# EAGLE schematic DM04mux (EAGLE 6.6.0)

## Sheet 1 of 3
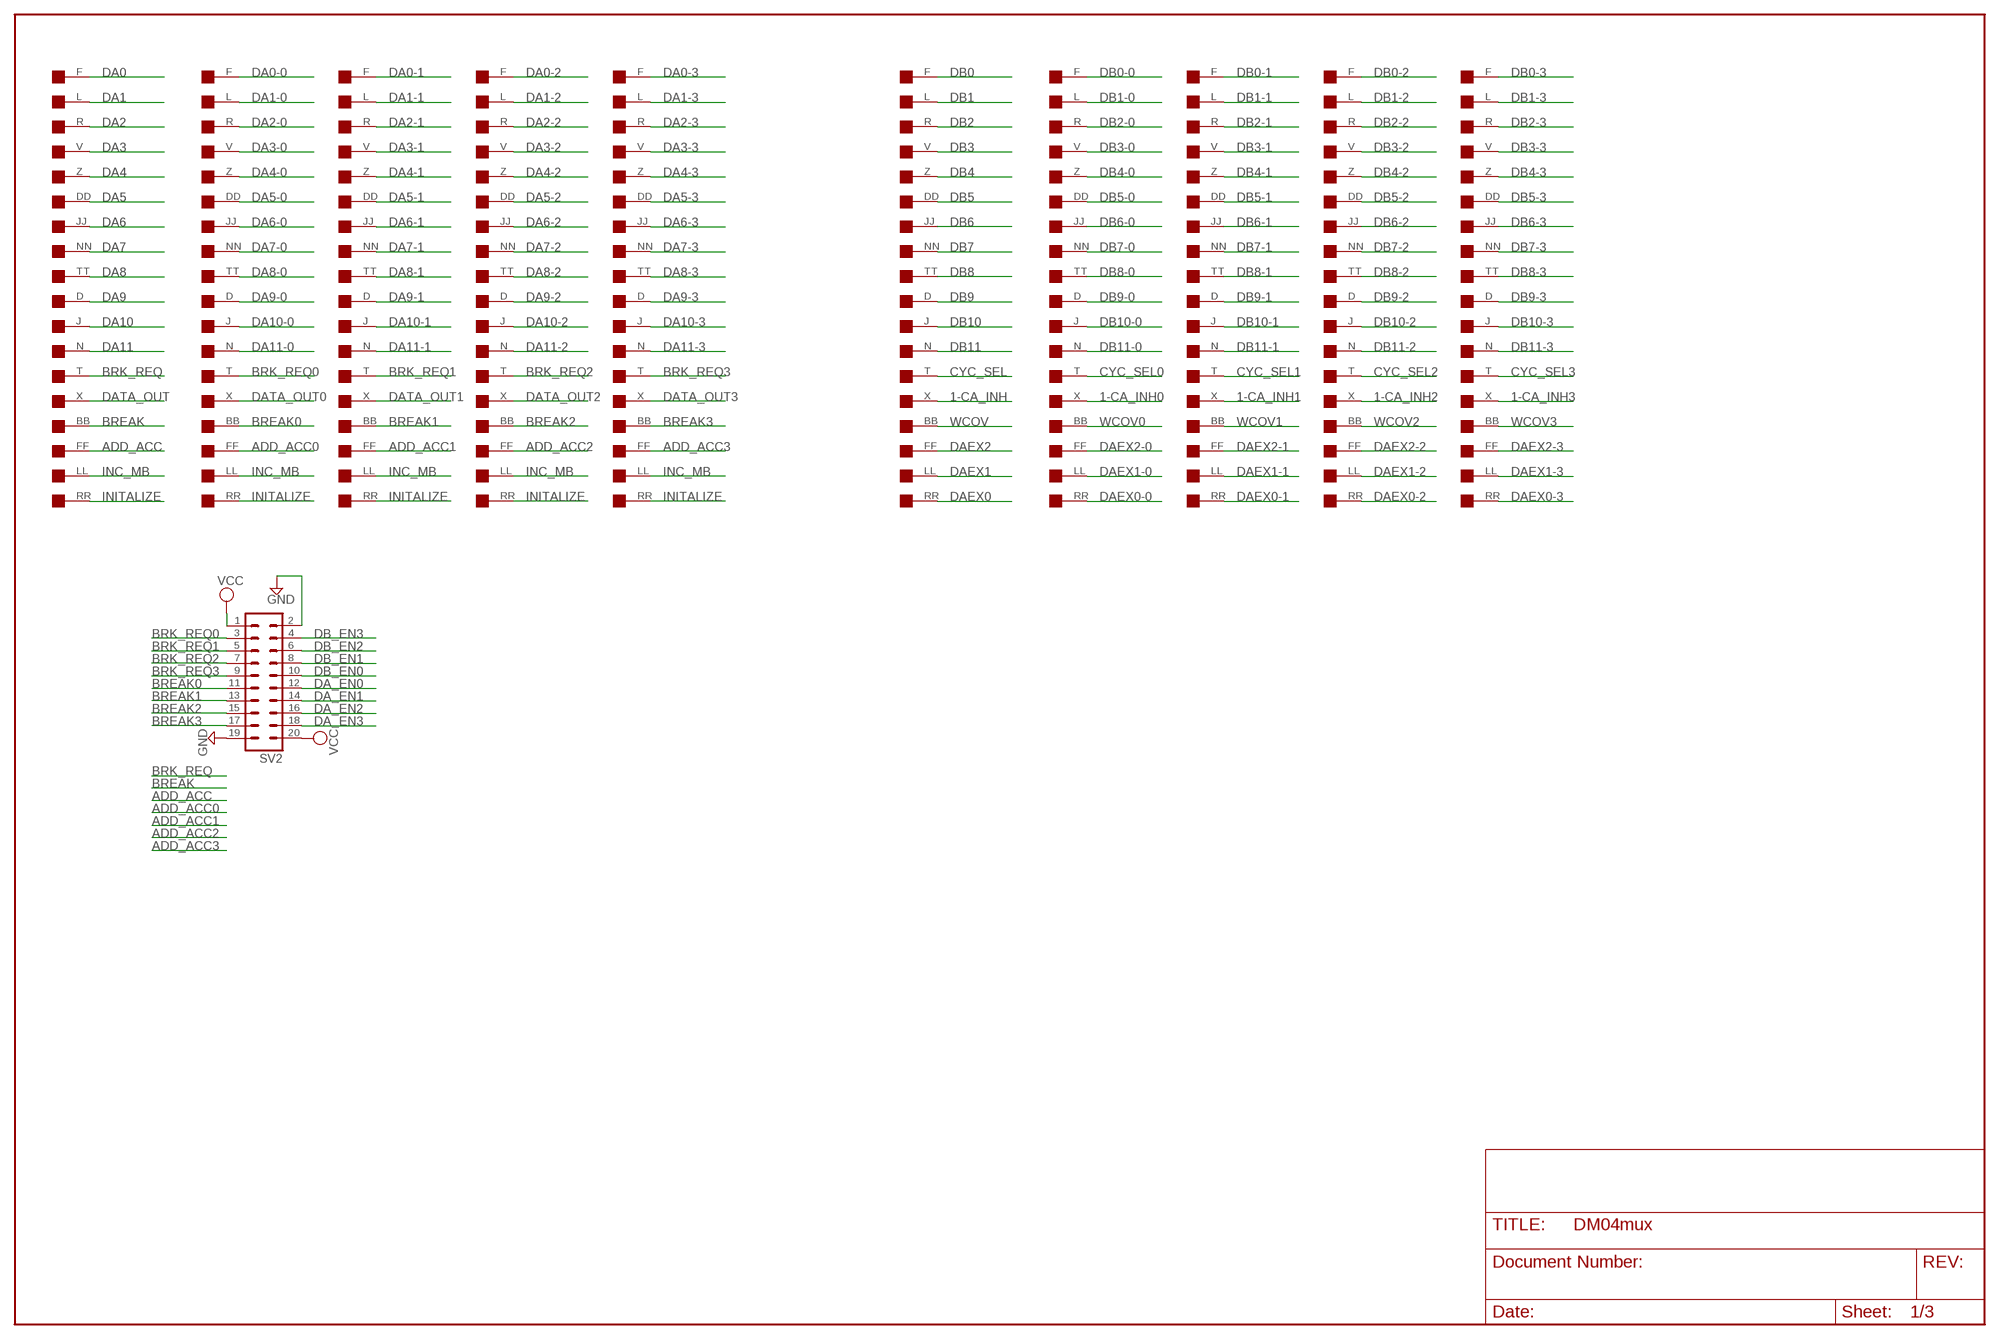
[diagram p0: schematic, sheet 1]

### Parts
SV2  MA10-2  [MA10-2]
U$1  BC08J  [DEC40PINV]
U$2  BC08J  [DEC40PINV]
U$3  BC08J  [DEC40PINV]
U$4  BC08J  [DEC40PINV]
U$5  BC08J  [DEC40PINV]
U$6  BC08J  [DEC40PINV]
U$7  BC08J  [DEC40PINV]
U$8  BC08J  [DEC40PINV]
U$9  BC08J  [DEC40PINV]
U$10  BC08J  [DEC40PINV]

### Nets
1-CA_INH: U$6.X ; also sheet 3
1-CA_INH0: U$7.X ; also sheet 3
1-CA_INH1: U$8.X ; also sheet 3
1-CA_INH2: U$9.X ; also sheet 3
1-CA_INH3: U$10.X ; also sheet 3
ADD_ACC: U$1.FF
ADD_ACC0: U$2.FF
ADD_ACC1: U$3.FF
ADD_ACC2: U$4.FF
ADD_ACC3: U$5.FF
BREAK: U$1.BB
BREAK0: SV2.11 U$2.BB
BREAK1: SV2.13 U$3.BB
BREAK2: SV2.15 U$4.BB
BREAK3: SV2.17 U$5.BB
BRK_REQ: U$1.T
BRK_REQ0: SV2.3 U$2.T
BRK_REQ1: SV2.5 U$3.T
BRK_REQ2: SV2.7 U$4.T
BRK_REQ3: SV2.9 U$5.T
CYC_SEL: U$6.T ; also sheet 2
CYC_SEL0: U$7.T ; also sheet 2
CYC_SEL1: U$8.T ; also sheet 2
CYC_SEL2: U$9.T ; also sheet 2
CYC_SEL3: U$10.T ; also sheet 2
DA0: U$1.F ; also sheet 2
DA0-0: U$2.F ; also sheet 2
DA0-1: U$3.F ; also sheet 2
DA0-2: U$4.F ; also sheet 2
DA0-3: U$5.F ; also sheet 2
DA1: U$1.L ; also sheet 2
DA1-0: U$2.L ; also sheet 2
DA1-1: U$3.L ; also sheet 2
DA1-2: U$4.L ; also sheet 2
DA1-3: U$5.L ; also sheet 2
DA2: U$1.R ; also sheet 2
DA2-0: U$2.R ; also sheet 2
DA2-1: U$3.R ; also sheet 2
DA2-2: U$4.R ; also sheet 2
DA2-3: U$5.R ; also sheet 2
DA3: U$1.V ; also sheet 2
DA3-0: U$2.V ; also sheet 2
DA3-1: U$3.V ; also sheet 2
DA3-2: U$4.V ; also sheet 2
DA3-3: U$5.V ; also sheet 2
DA4: U$1.Z ; also sheet 2
DA4-0: U$2.Z ; also sheet 2
DA4-1: U$3.Z ; also sheet 2
DA4-2: U$4.Z ; also sheet 2
DA4-3: U$5.Z ; also sheet 2
DA5: U$1.DD ; also sheet 2
DA5-0: U$2.DD ; also sheet 2
DA5-1: U$3.DD ; also sheet 2
DA5-2: U$4.DD ; also sheet 2
DA5-3: U$5.DD ; also sheet 2
DA6: U$1.JJ ; also sheet 2
DA6-0: U$2.JJ ; also sheet 2
DA6-1: U$3.JJ ; also sheet 2
DA6-2: U$4.JJ ; also sheet 2
DA6-3: U$5.JJ ; also sheet 2
DA7: U$1.NN ; also sheet 2
DA7-0: U$2.NN ; also sheet 2
DA7-1: U$3.NN ; also sheet 2
DA7-2: U$4.NN ; also sheet 2
DA7-3: U$5.NN ; also sheet 2
DA8: U$1.TT ; also sheet 2
DA8-0: U$2.TT ; also sheet 2
DA8-1: U$3.TT ; also sheet 2
DA8-2: U$4.TT ; also sheet 2
DA8-3: U$5.TT ; also sheet 2
DA9: U$1.D ; also sheet 2
DA9-0: U$2.D ; also sheet 2
DA9-1: U$3.D ; also sheet 2
DA9-2: U$4.D ; also sheet 2
DA9-3: U$5.D ; also sheet 2
DA10: U$1.J ; also sheet 2
DA10-0: U$2.J ; also sheet 2
DA10-1: U$3.J ; also sheet 2
DA10-2: U$4.J ; also sheet 2
DA10-3: U$5.J ; also sheet 2
DA11: U$1.N ; also sheet 2
DA11-0: U$2.N ; also sheet 2
DA11-1: U$3.N ; also sheet 2
DA11-2: U$4.N ; also sheet 2
DA11-3: U$5.N ; also sheet 2
DA_EN0: SV2.12 ; also sheet 2
DA_EN1: SV2.14 ; also sheet 2
DA_EN2: SV2.16 ; also sheet 2
DA_EN3: SV2.18 ; also sheet 2
DAEX0: U$6.RR ; also sheet 2
DAEX0-0: U$7.RR ; also sheet 2
DAEX0-1: U$8.RR ; also sheet 2
DAEX0-2: U$9.RR ; also sheet 2
DAEX0-3: U$10.RR ; also sheet 2
DAEX1: U$6.LL ; also sheet 2
DAEX1-0: U$7.LL ; also sheet 2
DAEX1-1: U$8.LL ; also sheet 2
DAEX1-2: U$9.LL ; also sheet 2
DAEX1-3: U$10.LL ; also sheet 2
DAEX2: U$6.FF ; also sheet 2
DAEX2-0: U$7.FF ; also sheet 2
DAEX2-1: U$8.FF ; also sheet 2
DAEX2-2: U$9.FF ; also sheet 2
DAEX2-3: U$10.FF ; also sheet 2
DATA_OUT: U$1.X ; also sheet 3
DATA_OUT0: U$2.X ; also sheet 3
DATA_OUT1: U$3.X ; also sheet 3
DATA_OUT2: U$4.X ; also sheet 3
DATA_OUT3: U$5.X ; also sheet 3
DB0: U$6.F ; also sheet 3
DB0-0: U$7.F ; also sheet 3
DB0-1: U$8.F ; also sheet 3
DB0-2: U$9.F ; also sheet 3
DB0-3: U$10.F ; also sheet 3
DB1: U$6.L ; also sheet 3
DB1-0: U$7.L ; also sheet 3
DB1-1: U$8.L ; also sheet 3
DB1-2: U$9.L ; also sheet 3
DB1-3: U$10.L ; also sheet 3
DB2: U$6.R ; also sheet 3
DB2-0: U$7.R ; also sheet 3
DB2-1: U$8.R ; also sheet 3
DB2-2: U$9.R ; also sheet 3
DB2-3: U$10.R ; also sheet 3
DB3: U$6.V ; also sheet 3
DB3-0: U$7.V ; also sheet 3
DB3-1: U$8.V ; also sheet 3
DB3-2: U$9.V ; also sheet 3
DB3-3: U$10.V ; also sheet 3
DB4: U$6.Z ; also sheet 3
DB4-0: U$7.Z ; also sheet 3
DB4-1: U$8.Z ; also sheet 3
DB4-2: U$9.Z ; also sheet 3
DB4-3: U$10.Z ; also sheet 3
DB5: U$6.DD ; also sheet 3
DB5-0: U$7.DD ; also sheet 3
DB5-1: U$8.DD ; also sheet 3
DB5-2: U$9.DD ; also sheet 3
DB5-3: U$10.DD ; also sheet 3
DB6: U$6.JJ ; also sheet 3
DB6-0: U$7.JJ ; also sheet 3
DB6-1: U$8.JJ ; also sheet 3
DB6-2: U$9.JJ ; also sheet 3
DB6-3: U$10.JJ ; also sheet 3
DB7: U$6.NN ; also sheet 3
DB7-0: U$7.NN ; also sheet 3
DB7-1: U$8.NN ; also sheet 3
DB7-2: U$9.NN ; also sheet 3
DB7-3: U$10.NN ; also sheet 3
DB8: U$6.TT ; also sheet 3
DB8-0: U$7.TT ; also sheet 3
DB8-1: U$8.TT ; also sheet 3
DB8-2: U$9.TT ; also sheet 3
DB8-3: U$10.TT ; also sheet 3
DB9: U$6.D ; also sheet 3
DB9-0: U$7.D ; also sheet 3
DB9-1: U$8.D ; also sheet 3
DB9-2: U$9.D ; also sheet 3
DB9-3: U$10.D ; also sheet 3
DB10: U$6.J ; also sheet 3
DB10-0: U$7.J ; also sheet 3
DB10-1: U$8.J ; also sheet 3
DB10-2: U$9.J ; also sheet 3
DB10-3: U$10.J ; also sheet 3
DB11: U$6.N ; also sheet 3
DB11-0: U$7.N ; also sheet 3
DB11-1: U$8.N ; also sheet 3
DB11-2: U$9.N ; also sheet 3
DB11-3: U$10.N ; also sheet 3
DB_EN0: SV2.10 ; also sheet 3
DB_EN1: SV2.8 ; also sheet 3
DB_EN2: SV2.6 ; also sheet 3
DB_EN3: SV2.4 ; also sheet 3
GND: SV2.2 SV2.19 ; also sheet 3
INC_MB: U$1.LL U$2.LL U$3.LL U$4.LL U$5.LL
INITALIZE: U$1.RR U$2.RR U$3.RR U$4.RR U$5.RR
VCC: SV2.1 SV2.20 ; also sheet 2,3
WCOV: U$6.BB
WCOV0: U$7.BB
WCOV1: U$8.BB
WCOV2: U$9.BB
WCOV3: U$10.BB

## Sheet 2 of 3
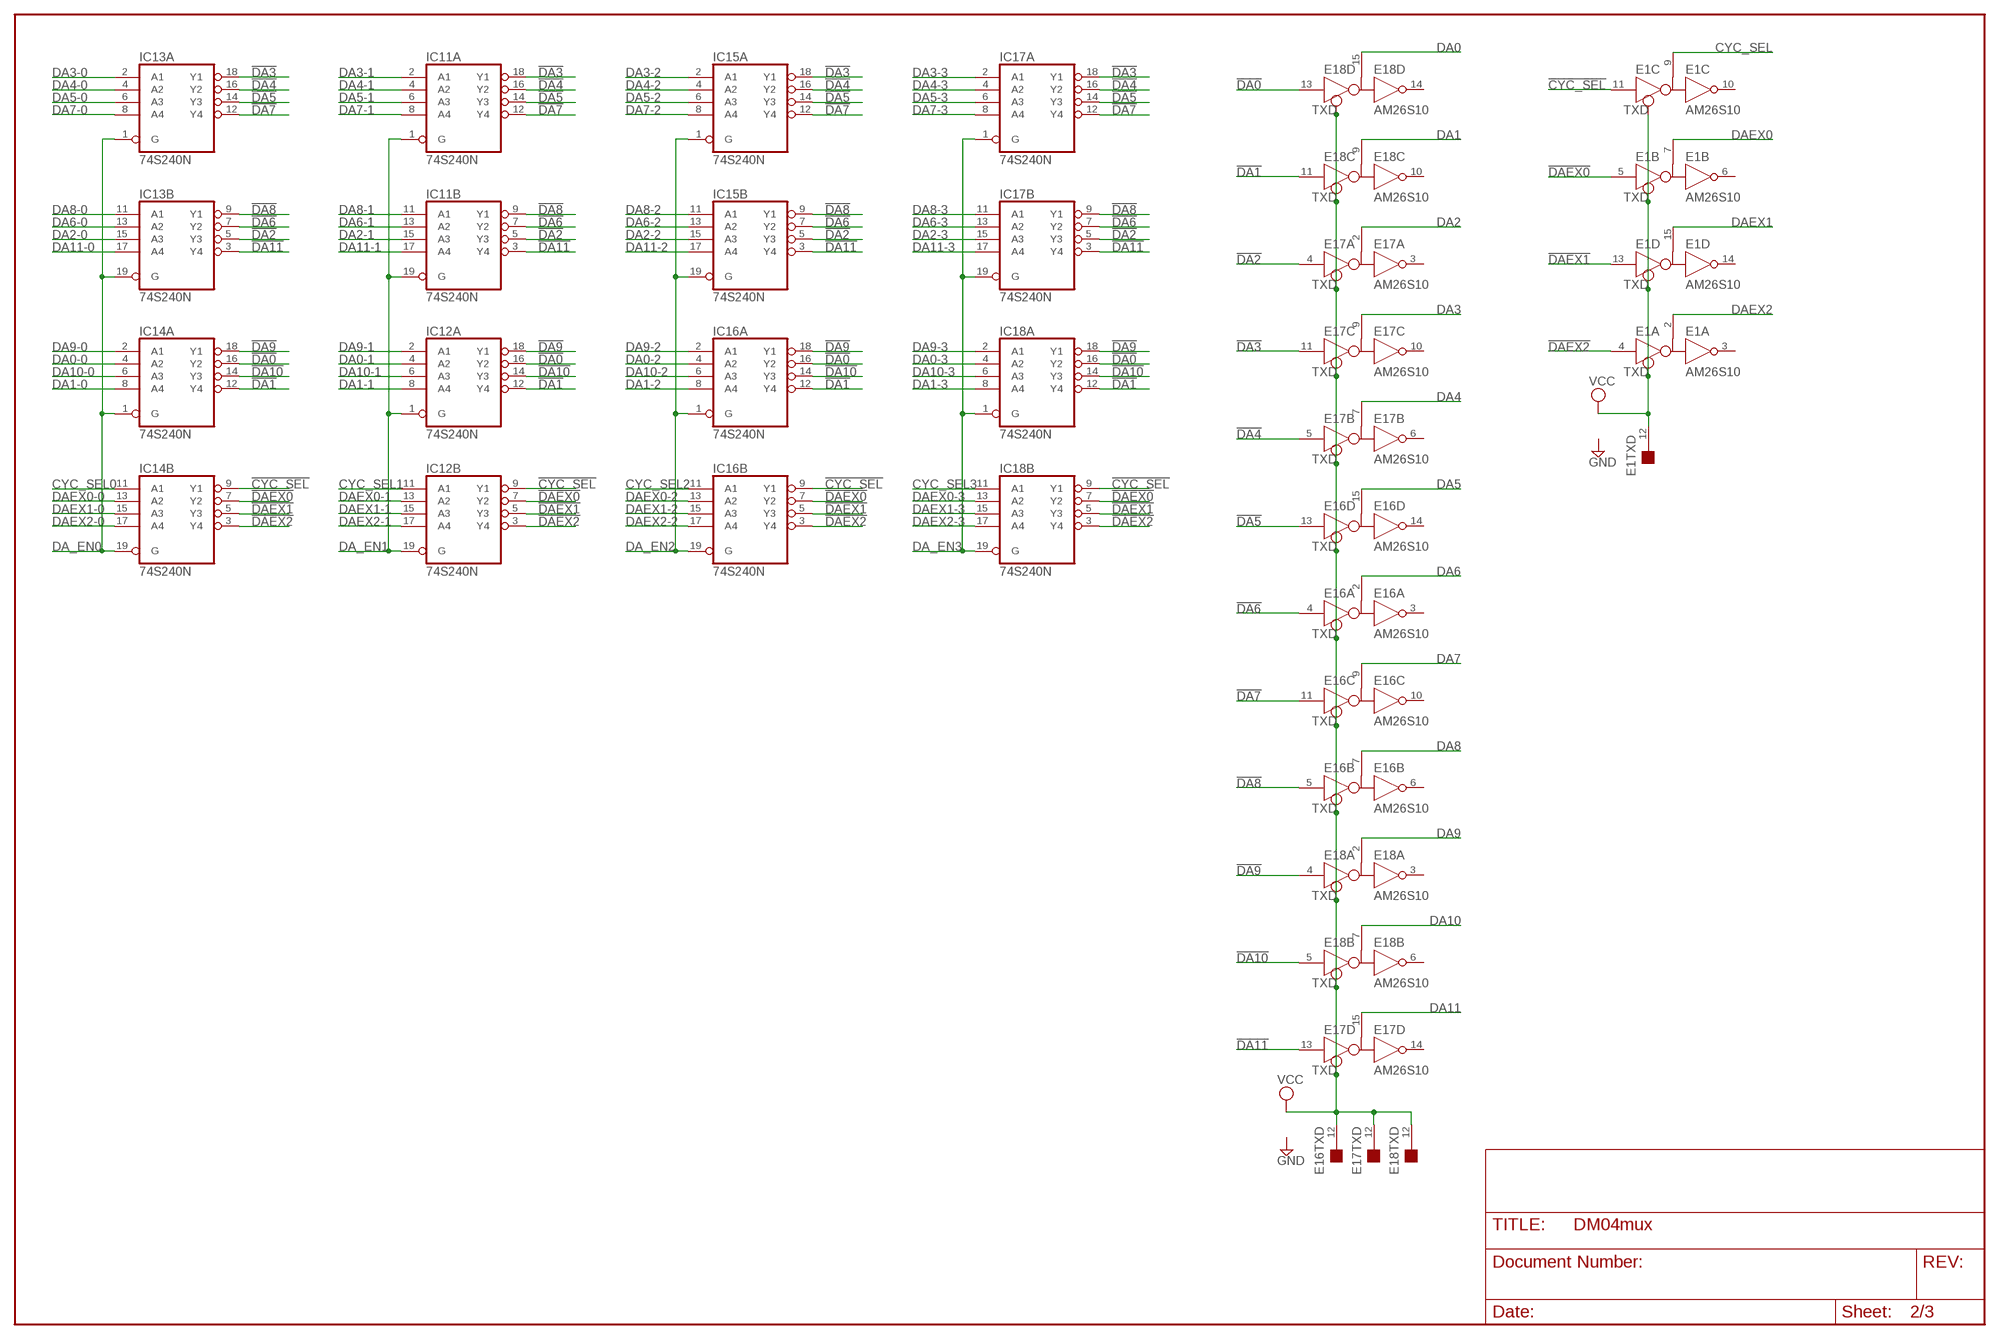
[diagram p1: schematic, sheet 2]

### Parts
E1  AM26S10  [DIL16]
E16  AM26S10  [DIL16]
E17  AM26S10  [DIL16]
E18  AM26S10  [DIL16]
IC11  74S240N  [DIL20]
IC12  74S240N  [DIL20]
IC13  74S240N  [DIL20]
IC14  74S240N  [DIL20]
IC15  74S240N  [DIL20]
IC16  74S240N  [DIL20]
IC17  74S240N  [DIL20]
IC18  74S240N  [DIL20]

### Nets
!CYC_SEL: E1.11(C:D) IC12.9(B:Y1) IC14.9(B:Y1) IC16.9(B:Y1) IC18.9(B:Y1)
!DA0: E18.13(D:D) IC12.16(A:Y2) IC14.16(A:Y2) IC16.16(A:Y2) IC18.16(A:Y2)
!DA1: E18.11(C:D) IC12.12(A:Y4) IC14.12(A:Y4) IC16.12(A:Y4) IC18.12(A:Y4)
!DA2: E17.4(A:D) IC11.5(B:Y3) IC13.5(B:Y3) IC15.5(B:Y3) IC17.5(B:Y3)
!DA3: E17.11(C:D) IC11.18(A:Y1) IC13.18(A:Y1) IC15.18(A:Y1) IC17.18(A:Y1)
!DA4: E17.5(B:D) IC11.16(A:Y2) IC13.16(A:Y2) IC15.16(A:Y2) IC17.16(A:Y2)
!DA5: E16.13(D:D) IC11.14(A:Y3) IC13.14(A:Y3) IC15.14(A:Y3) IC17.14(A:Y3)
!DA6: E16.4(A:D) IC11.7(B:Y2) IC13.7(B:Y2) IC15.7(B:Y2) IC17.7(B:Y2)
!DA7: E16.11(C:D) IC11.12(A:Y4) IC13.12(A:Y4) IC15.12(A:Y4) IC17.12(A:Y4)
!DA8: E16.5(B:D) IC11.9(B:Y1) IC13.9(B:Y1) IC15.9(B:Y1) IC17.9(B:Y1)
!DA9: E18.4(A:D) IC12.18(A:Y1) IC14.18(A:Y1) IC16.18(A:Y1) IC18.18(A:Y1)
!DA10: E18.5(B:D) IC12.14(A:Y3) IC14.14(A:Y3) IC16.14(A:Y3) IC18.14(A:Y3)
!DA11: E17.13(D:D) IC11.3(B:Y4) IC13.3(B:Y4) IC15.3(B:Y4) IC17.3(B:Y4)
!DAEX0: E1.5(B:D) IC12.7(B:Y2) IC14.7(B:Y2) IC16.7(B:Y2) IC18.7(B:Y2)
!DAEX1: E1.13(D:D) IC12.5(B:Y3) IC14.5(B:Y3) IC16.5(B:Y3) IC18.5(B:Y3)
!DAEX2: E1.4(A:D) IC12.3(B:Y4) IC14.3(B:Y4) IC16.3(B:Y4) IC18.3(B:Y4)
CYC_SEL: E1.9(C:B) ; also sheet 1
CYC_SEL0: IC14.11(B:A1) ; also sheet 1
CYC_SEL1: IC12.11(B:A1) ; also sheet 1
CYC_SEL2: IC16.11(B:A1) ; also sheet 1
CYC_SEL3: IC18.11(B:A1) ; also sheet 1
DA0: E18.15(D:B) ; also sheet 1
DA0-0: IC14.4(A:A2) ; also sheet 1
DA0-1: IC12.4(A:A2) ; also sheet 1
DA0-2: IC16.4(A:A2) ; also sheet 1
DA0-3: IC18.4(A:A2) ; also sheet 1
DA1: E18.9(C:B) ; also sheet 1
DA1-0: IC14.8(A:A4) ; also sheet 1
DA1-1: IC12.8(A:A4) ; also sheet 1
DA1-2: IC16.8(A:A4) ; also sheet 1
DA1-3: IC18.8(A:A4) ; also sheet 1
DA2: E17.2(A:B) ; also sheet 1
DA2-0: IC13.15(B:A3) ; also sheet 1
DA2-1: IC11.15(B:A3) ; also sheet 1
DA2-2: IC15.15(B:A3) ; also sheet 1
DA2-3: IC17.15(B:A3) ; also sheet 1
DA3: E17.9(C:B) ; also sheet 1
DA3-0: IC13.2(A:A1) ; also sheet 1
DA3-1: IC11.2(A:A1) ; also sheet 1
DA3-2: IC15.2(A:A1) ; also sheet 1
DA3-3: IC17.2(A:A1) ; also sheet 1
DA4: E17.7(B:B) ; also sheet 1
DA4-0: IC13.4(A:A2) ; also sheet 1
DA4-1: IC11.4(A:A2) ; also sheet 1
DA4-2: IC15.4(A:A2) ; also sheet 1
DA4-3: IC17.4(A:A2) ; also sheet 1
DA5: E16.15(D:B) ; also sheet 1
DA5-0: IC13.6(A:A3) ; also sheet 1
DA5-1: IC11.6(A:A3) ; also sheet 1
DA5-2: IC15.6(A:A3) ; also sheet 1
DA5-3: IC17.6(A:A3) ; also sheet 1
DA6: E16.2(A:B) ; also sheet 1
DA6-0: IC13.13(B:A2) ; also sheet 1
DA6-1: IC11.13(B:A2) ; also sheet 1
DA6-2: IC15.13(B:A2) ; also sheet 1
DA6-3: IC17.13(B:A2) ; also sheet 1
DA7: E16.9(C:B) ; also sheet 1
DA7-0: IC13.8(A:A4) ; also sheet 1
DA7-1: IC11.8(A:A4) ; also sheet 1
DA7-2: IC15.8(A:A4) ; also sheet 1
DA7-3: IC17.8(A:A4) ; also sheet 1
DA8: E16.7(B:B) ; also sheet 1
DA8-0: IC13.11(B:A1) ; also sheet 1
DA8-1: IC11.11(B:A1) ; also sheet 1
DA8-2: IC15.11(B:A1) ; also sheet 1
DA8-3: IC17.11(B:A1) ; also sheet 1
DA9: E18.2(A:B) ; also sheet 1
DA9-0: IC14.2(A:A1) ; also sheet 1
DA9-1: IC12.2(A:A1) ; also sheet 1
DA9-2: IC16.2(A:A1) ; also sheet 1
DA9-3: IC18.2(A:A1) ; also sheet 1
DA10: E18.7(B:B) ; also sheet 1
DA10-0: IC14.6(A:A3) ; also sheet 1
DA10-1: IC12.6(A:A3) ; also sheet 1
DA10-2: IC16.6(A:A3) ; also sheet 1
DA10-3: IC18.6(A:A3) ; also sheet 1
DA11: E17.15(D:B) ; also sheet 1
DA11-0: IC13.17(B:A4) ; also sheet 1
DA11-1: IC11.17(B:A4) ; also sheet 1
DA11-2: IC15.17(B:A4) ; also sheet 1
DA11-3: IC17.17(B:A4) ; also sheet 1
DA_EN0: IC13.1(A:G) IC13.19(B:G) IC14.1(A:G) IC14.19(B:G) ; also sheet 1
DA_EN1: IC11.1(A:G) IC11.19(B:G) IC12.1(A:G) IC12.19(B:G) ; also sheet 1
DA_EN2: IC15.1(A:G) IC15.19(B:G) IC16.1(A:G) IC16.19(B:G) ; also sheet 1
DA_EN3: IC17.1(A:G) IC17.19(B:G) IC18.1(A:G) IC18.19(B:G) ; also sheet 1
DAEX0: E1.7(B:B) ; also sheet 1
DAEX0-0: IC14.13(B:A2) ; also sheet 1
DAEX0-1: IC12.13(B:A2) ; also sheet 1
DAEX0-2: IC16.13(B:A2) ; also sheet 1
DAEX0-3: IC18.13(B:A2) ; also sheet 1
DAEX1: E1.15(D:B) ; also sheet 1
DAEX1-0: IC14.15(B:A3) ; also sheet 1
DAEX1-1: IC12.15(B:A3) ; also sheet 1
DAEX1-2: IC16.15(B:A3) ; also sheet 1
DAEX1-3: IC18.15(B:A3) ; also sheet 1
DAEX2: E1.2(A:B) ; also sheet 1
DAEX2-0: IC14.17(B:A4) ; also sheet 1
DAEX2-1: IC12.17(B:A4) ; also sheet 1
DAEX2-2: IC16.17(B:A4) ; also sheet 1
DAEX2-3: IC18.17(B:A4) ; also sheet 1
VCC: E1.12(TXD:TXD) E16.12(TXD:TXD) E17.12(TXD:TXD) E18.12(TXD:TXD) ; also sheet 1,3
Unconnected: E1.3(A:R) E1.6(B:R) E1.10(C:R) E1.14(D:R) E16.3(A:R) E16.6(B:R) E16.10(C:R) E16.14(D:R) E17.3(A:R) E17.6(B:R) E17.10(C:R) E17.14(D:R) E18.3(A:R) E18.6(B:R) E18.10(C:R) E18.14(D:R)

## Sheet 3 of 3
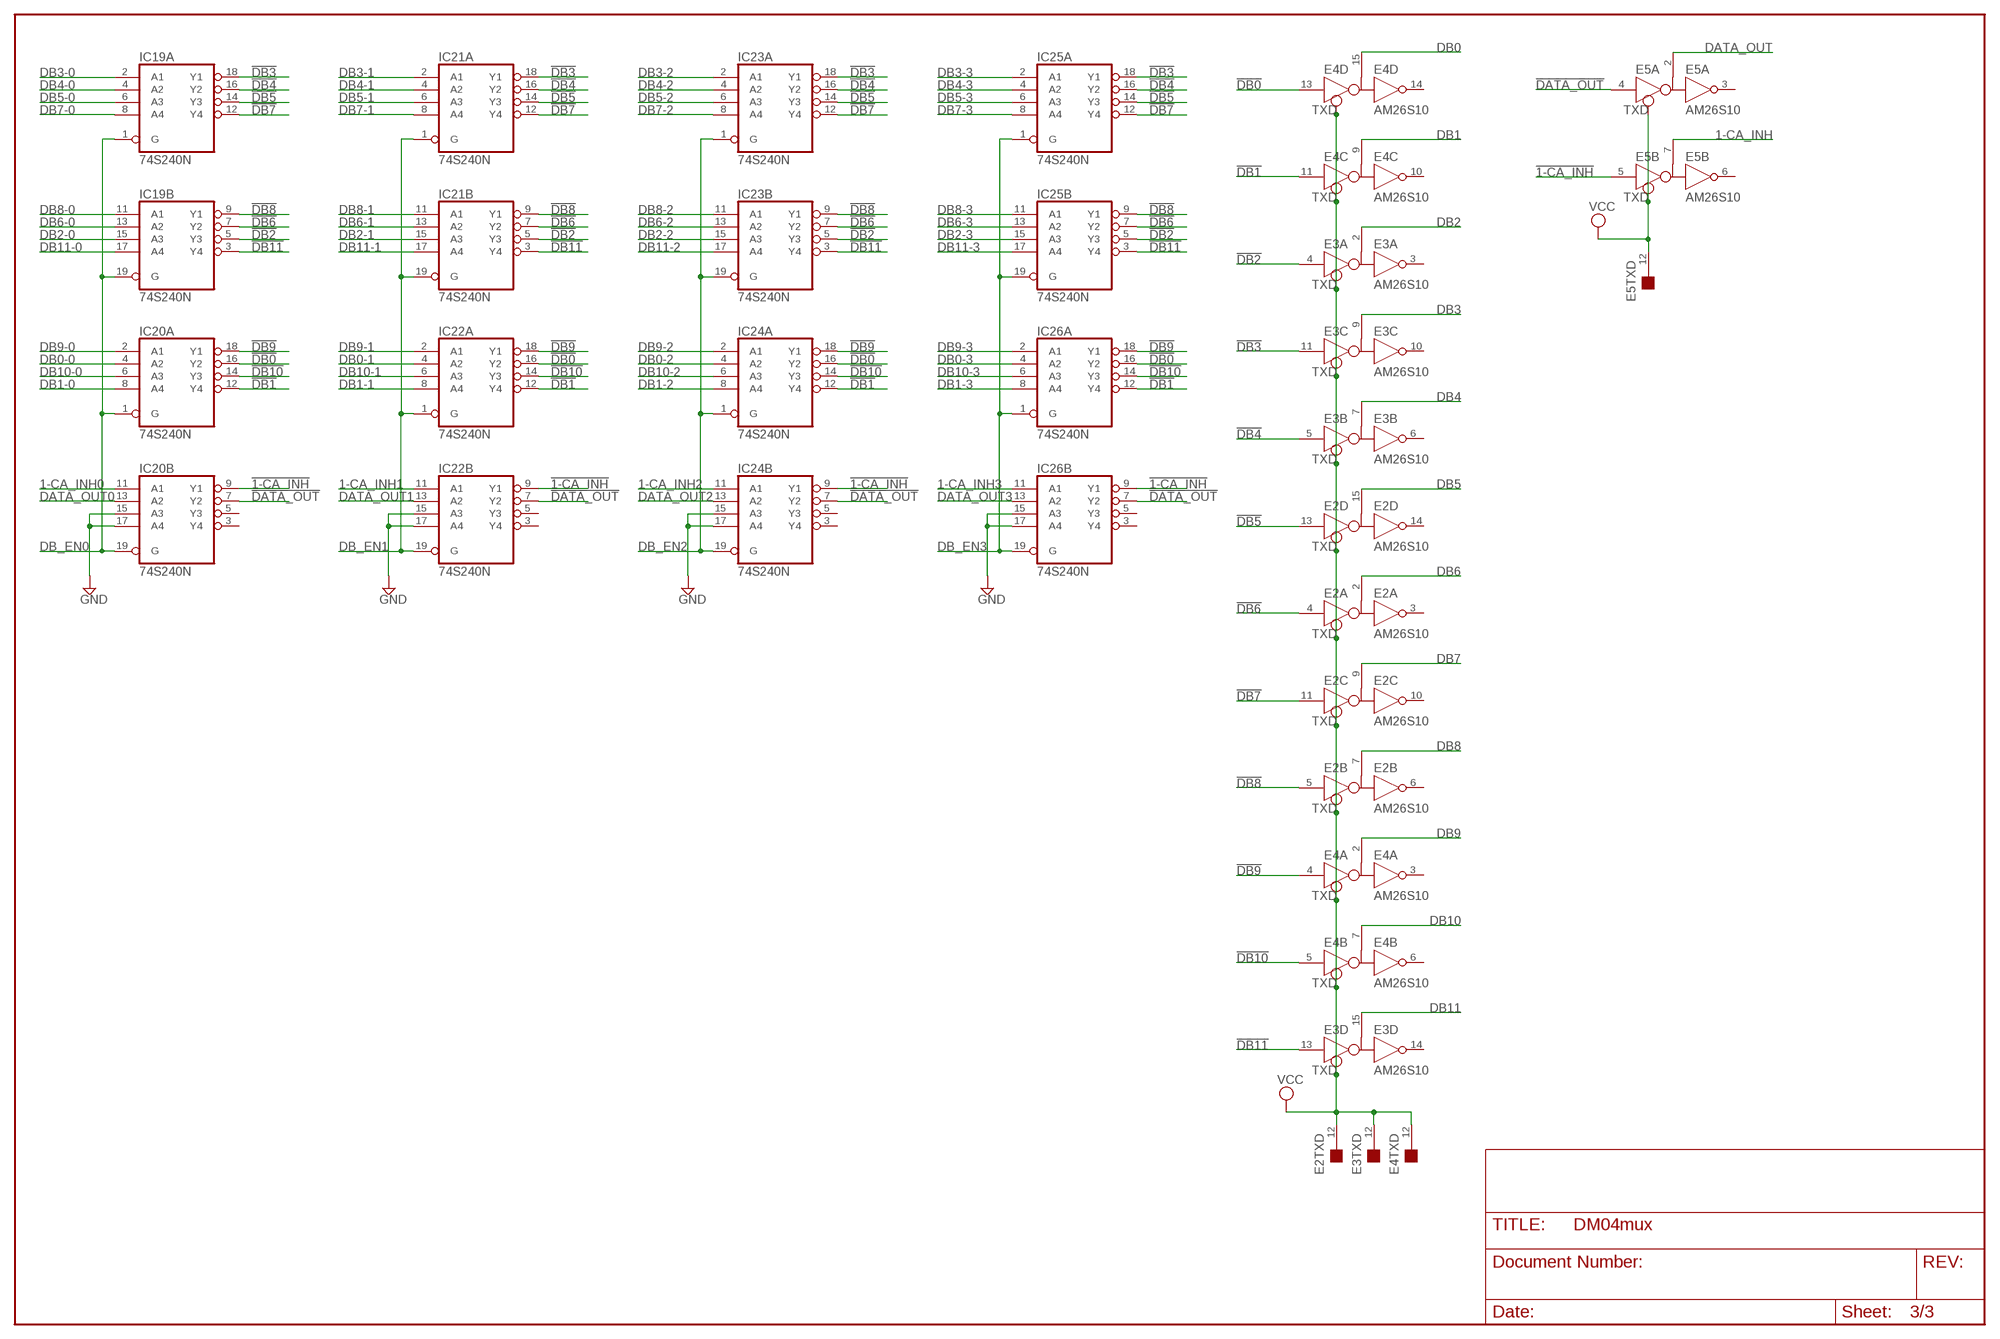
[diagram p2: schematic, sheet 3]

### Parts
E2  AM26S10  [DIL16]
E3  AM26S10  [DIL16]
E4  AM26S10  [DIL16]
E5  AM26S10  [DIL16]
IC19  74S240N  [DIL20]
IC20  74S240N  [DIL20]
IC21  74S240N  [DIL20]
IC22  74S240N  [DIL20]
IC23  74S240N  [DIL20]
IC24  74S240N  [DIL20]
IC25  74S240N  [DIL20]
IC26  74S240N  [DIL20]

### Nets
1-CA_INH: E5.7(B:B) ; also sheet 1
1-CA_INH0: IC20.11(B:A1) ; also sheet 1
1-CA_INH1: IC22.11(B:A1) ; also sheet 1
1-CA_INH2: IC24.11(B:A1) ; also sheet 1
1-CA_INH3: IC26.11(B:A1) ; also sheet 1
!1-CA_INH: E5.5(B:D) IC20.9(B:Y1) IC22.9(B:Y1) IC24.9(B:Y1) IC26.9(B:Y1)
!DATA_OUT: E5.4(A:D) IC20.7(B:Y2) IC22.7(B:Y2) IC24.7(B:Y2) IC26.7(B:Y2)
!DB0: E4.13(D:D) IC20.16(A:Y2) IC22.16(A:Y2) IC24.16(A:Y2) IC26.16(A:Y2)
!DB1: E4.11(C:D) IC20.12(A:Y4) IC22.12(A:Y4) IC24.12(A:Y4) IC26.12(A:Y4)
!DB2: E3.4(A:D) IC19.5(B:Y3) IC21.5(B:Y3) IC23.5(B:Y3) IC25.5(B:Y3)
!DB3: E3.11(C:D) IC19.18(A:Y1) IC21.18(A:Y1) IC23.18(A:Y1) IC25.18(A:Y1)
!DB4: E3.5(B:D) IC19.16(A:Y2) IC21.16(A:Y2) IC23.16(A:Y2) IC25.16(A:Y2)
!DB5: E2.13(D:D) IC19.14(A:Y3) IC21.14(A:Y3) IC23.14(A:Y3) IC25.14(A:Y3)
!DB6: E2.4(A:D) IC19.7(B:Y2) IC21.7(B:Y2) IC23.7(B:Y2) IC25.7(B:Y2)
!DB7: E2.11(C:D) IC19.12(A:Y4) IC21.12(A:Y4) IC23.12(A:Y4) IC25.12(A:Y4)
!DB8: E2.5(B:D) IC19.9(B:Y1) IC21.9(B:Y1) IC23.9(B:Y1) IC25.9(B:Y1)
!DB9: E4.4(A:D) IC20.18(A:Y1) IC22.18(A:Y1) IC24.18(A:Y1) IC26.18(A:Y1)
!DB10: E4.5(B:D) IC20.14(A:Y3) IC22.14(A:Y3) IC24.14(A:Y3) IC26.14(A:Y3)
!DB11: E3.13(D:D) IC19.3(B:Y4) IC21.3(B:Y4) IC23.3(B:Y4) IC25.3(B:Y4)
DATA_OUT: E5.2(A:B) ; also sheet 1
DATA_OUT0: IC20.13(B:A2) ; also sheet 1
DATA_OUT1: IC22.13(B:A2) ; also sheet 1
DATA_OUT2: IC24.13(B:A2) ; also sheet 1
DATA_OUT3: IC26.13(B:A2) ; also sheet 1
DB0: E4.15(D:B) ; also sheet 1
DB0-0: IC20.4(A:A2) ; also sheet 1
DB0-1: IC22.4(A:A2) ; also sheet 1
DB0-2: IC24.4(A:A2) ; also sheet 1
DB0-3: IC26.4(A:A2) ; also sheet 1
DB1: E4.9(C:B) ; also sheet 1
DB1-0: IC20.8(A:A4) ; also sheet 1
DB1-1: IC22.8(A:A4) ; also sheet 1
DB1-2: IC24.8(A:A4) ; also sheet 1
DB1-3: IC26.8(A:A4) ; also sheet 1
DB2: E3.2(A:B) ; also sheet 1
DB2-0: IC19.15(B:A3) ; also sheet 1
DB2-1: IC21.15(B:A3) ; also sheet 1
DB2-2: IC23.15(B:A3) ; also sheet 1
DB2-3: IC25.15(B:A3) ; also sheet 1
DB3: E3.9(C:B) ; also sheet 1
DB3-0: IC19.2(A:A1) ; also sheet 1
DB3-1: IC21.2(A:A1) ; also sheet 1
DB3-2: IC23.2(A:A1) ; also sheet 1
DB3-3: IC25.2(A:A1) ; also sheet 1
DB4: E3.7(B:B) ; also sheet 1
DB4-0: IC19.4(A:A2) ; also sheet 1
DB4-1: IC21.4(A:A2) ; also sheet 1
DB4-2: IC23.4(A:A2) ; also sheet 1
DB4-3: IC25.4(A:A2) ; also sheet 1
DB5: E2.15(D:B) ; also sheet 1
DB5-0: IC19.6(A:A3) ; also sheet 1
DB5-1: IC21.6(A:A3) ; also sheet 1
DB5-2: IC23.6(A:A3) ; also sheet 1
DB5-3: IC25.6(A:A3) ; also sheet 1
DB6: E2.2(A:B) ; also sheet 1
DB6-0: IC19.13(B:A2) ; also sheet 1
DB6-1: IC21.13(B:A2) ; also sheet 1
DB6-2: IC23.13(B:A2) ; also sheet 1
DB6-3: IC25.13(B:A2) ; also sheet 1
DB7: E2.9(C:B) ; also sheet 1
DB7-0: IC19.8(A:A4) ; also sheet 1
DB7-1: IC21.8(A:A4) ; also sheet 1
DB7-2: IC23.8(A:A4) ; also sheet 1
DB7-3: IC25.8(A:A4) ; also sheet 1
DB8: E2.7(B:B) ; also sheet 1
DB8-0: IC19.11(B:A1) ; also sheet 1
DB8-1: IC21.11(B:A1) ; also sheet 1
DB8-2: IC23.11(B:A1) ; also sheet 1
DB8-3: IC25.11(B:A1) ; also sheet 1
DB9: E4.2(A:B) ; also sheet 1
DB9-0: IC20.2(A:A1) ; also sheet 1
DB9-1: IC22.2(A:A1) ; also sheet 1
DB9-2: IC24.2(A:A1) ; also sheet 1
DB9-3: IC26.2(A:A1) ; also sheet 1
DB10: E4.7(B:B) ; also sheet 1
DB10-0: IC20.6(A:A3) ; also sheet 1
DB10-1: IC22.6(A:A3) ; also sheet 1
DB10-2: IC24.6(A:A3) ; also sheet 1
DB10-3: IC26.6(A:A3) ; also sheet 1
DB11: E3.15(D:B) ; also sheet 1
DB11-0: IC19.17(B:A4) ; also sheet 1
DB11-1: IC21.17(B:A4) ; also sheet 1
DB11-2: IC23.17(B:A4) ; also sheet 1
DB11-3: IC25.17(B:A4) ; also sheet 1
DB_EN0: IC19.1(A:G) IC19.19(B:G) IC20.1(A:G) IC20.19(B:G) ; also sheet 1
DB_EN1: IC21.1(A:G) IC21.19(B:G) IC22.1(A:G) IC22.19(B:G) ; also sheet 1
DB_EN2: IC23.1(A:G) IC23.19(B:G) IC24.1(A:G) IC24.19(B:G) ; also sheet 1
DB_EN3: IC25.1(A:G) IC25.19(B:G) IC26.1(A:G) IC26.19(B:G) ; also sheet 1
GND: IC20.15(B:A3) IC20.17(B:A4) IC22.15(B:A3) IC22.17(B:A4) IC24.15(B:A3) IC24.17(B:A4) IC26.15(B:A3) IC26.17(B:A4) ; also sheet 1
VCC: E2.12(TXD:TXD) E3.12(TXD:TXD) E4.12(TXD:TXD) E5.12(TXD:TXD) ; also sheet 1,2
Unconnected: E2.3(A:R) E2.6(B:R) E2.10(C:R) E2.14(D:R) E3.3(A:R) E3.6(B:R) E3.10(C:R) E3.14(D:R) E4.3(A:R) E4.6(B:R) E4.10(C:R) E4.14(D:R) E5.3(A:R) E5.6(B:R) E5.9(C:B) E5.10(C:R) E5.11(C:D) E5.13(D:D) E5.14(D:R) E5.15(D:B) IC20.3(B:Y4) IC20.5(B:Y3) IC22.3(B:Y4) IC22.5(B:Y3) IC24.3(B:Y4) IC24.5(B:Y3) IC26.3(B:Y4) IC26.5(B:Y3)

## Power pins joined to a net without a drawn wire
GND: E1.1(GND:GND) E1.8(PWR:GND) E2.1(GND:GND) E2.8(PWR:GND) E3.1(GND:GND) E3.8(PWR:GND) E4.1(GND:GND) E4.8(PWR:GND) E5.1(GND:GND) E5.8(PWR:GND) E16.1(GND:GND) E16.8(PWR:GND) E17.1(GND:GND) E17.8(PWR:GND) E18.1(GND:GND) E18.8(PWR:GND) IC11.10(P:GND) IC12.10(P:GND) IC13.10(P:GND) IC14.10(P:GND) IC15.10(P:GND) IC16.10(P:GND) IC17.10(P:GND) IC18.10(P:GND) IC19.10(P:GND) IC20.10(P:GND) IC21.10(P:GND) IC22.10(P:GND) IC23.10(P:GND) IC24.10(P:GND) IC25.10(P:GND) IC26.10(P:GND) U$1.A U$1.AA U$1.B U$1.C U$1.CC U$1.E U$1.EE U$1.H U$1.HH U$1.K U$1.KK U$1.M U$1.MM U$1.P U$1.PP U$1.S U$1.SS U$1.U U$1.UU U$1.VV U$1.W U$1.Y U$2.A U$2.AA U$2.B U$2.C U$2.CC U$2.E U$2.EE U$2.H U$2.HH U$2.K U$2.KK U$2.M U$2.MM U$2.P U$2.PP U$2.S U$2.SS U$2.U U$2.UU U$2.VV U$2.W U$2.Y U$3.A U$3.AA U$3.B U$3.C U$3.CC U$3.E U$3.EE U$3.H U$3.HH U$3.K U$3.KK U$3.M U$3.MM U$3.P U$3.PP U$3.S U$3.SS U$3.U U$3.UU U$3.VV U$3.W U$3.Y U$4.A U$4.AA U$4.B U$4.C U$4.CC U$4.E U$4.EE U$4.H U$4.HH U$4.K U$4.KK U$4.M U$4.MM U$4.P U$4.PP U$4.S U$4.SS U$4.U U$4.UU U$4.VV U$4.W U$4.Y U$5.A U$5.AA U$5.B U$5.C U$5.CC U$5.E U$5.EE U$5.H U$5.HH U$5.K U$5.KK U$5.M U$5.MM U$5.P U$5.PP U$5.S U$5.SS U$5.U U$5.UU U$5.VV U$5.W U$5.Y U$6.A U$6.AA U$6.B U$6.C U$6.CC U$6.E U$6.EE U$6.H U$6.HH U$6.K U$6.KK U$6.M U$6.MM U$6.P U$6.PP U$6.S U$6.SS U$6.U U$6.UU U$6.VV U$6.W U$6.Y U$7.A U$7.AA U$7.B U$7.C U$7.CC U$7.E U$7.EE U$7.H U$7.HH U$7.K U$7.KK U$7.M U$7.MM U$7.P U$7.PP U$7.S U$7.SS U$7.U U$7.UU U$7.VV U$7.W U$7.Y U$8.A U$8.AA U$8.B U$8.C U$8.CC U$8.E U$8.EE U$8.H U$8.HH U$8.K U$8.KK U$8.M U$8.MM U$8.P U$8.PP U$8.S U$8.SS U$8.U U$8.UU U$8.VV U$8.W U$8.Y U$9.A U$9.AA U$9.B U$9.C U$9.CC U$9.E U$9.EE U$9.H U$9.HH U$9.K U$9.KK U$9.M U$9.MM U$9.P U$9.PP U$9.S U$9.SS U$9.U U$9.UU U$9.VV U$9.W U$9.Y U$10.A U$10.AA U$10.B U$10.C U$10.CC U$10.E U$10.EE U$10.H U$10.HH U$10.K U$10.KK U$10.M U$10.MM U$10.P U$10.PP U$10.S U$10.SS U$10.U U$10.UU U$10.VV U$10.W U$10.Y
VCC: E1.16(PWR:VCC) E2.16(PWR:VCC) E3.16(PWR:VCC) E4.16(PWR:VCC) E5.16(PWR:VCC) E16.16(PWR:VCC) E17.16(PWR:VCC) E18.16(PWR:VCC) IC11.20(P:VCC) IC12.20(P:VCC) IC13.20(P:VCC) IC14.20(P:VCC) IC15.20(P:VCC) IC16.20(P:VCC) IC17.20(P:VCC) IC18.20(P:VCC) IC19.20(P:VCC) IC20.20(P:VCC) IC21.20(P:VCC) IC22.20(P:VCC) IC23.20(P:VCC) IC24.20(P:VCC) IC25.20(P:VCC) IC26.20(P:VCC)

## Library data of the parts
E1-E5 E16-E18 = dec-con:AM26S10: Bus Transceiver
IC11-IC26 = 74xx-us:74*240: Octal BUFFER and LINE DRIVER, 3-state
SV2 = con-lstb:MA10-2: PIN HEADER; OC_FARNELL: unknown; OC_NEWARK: unknown
U$1-U$10 = dec-con:BC08J: BC08J compatible bus connector